# Altium schematic sheet 3G4G.SchDoc
size C
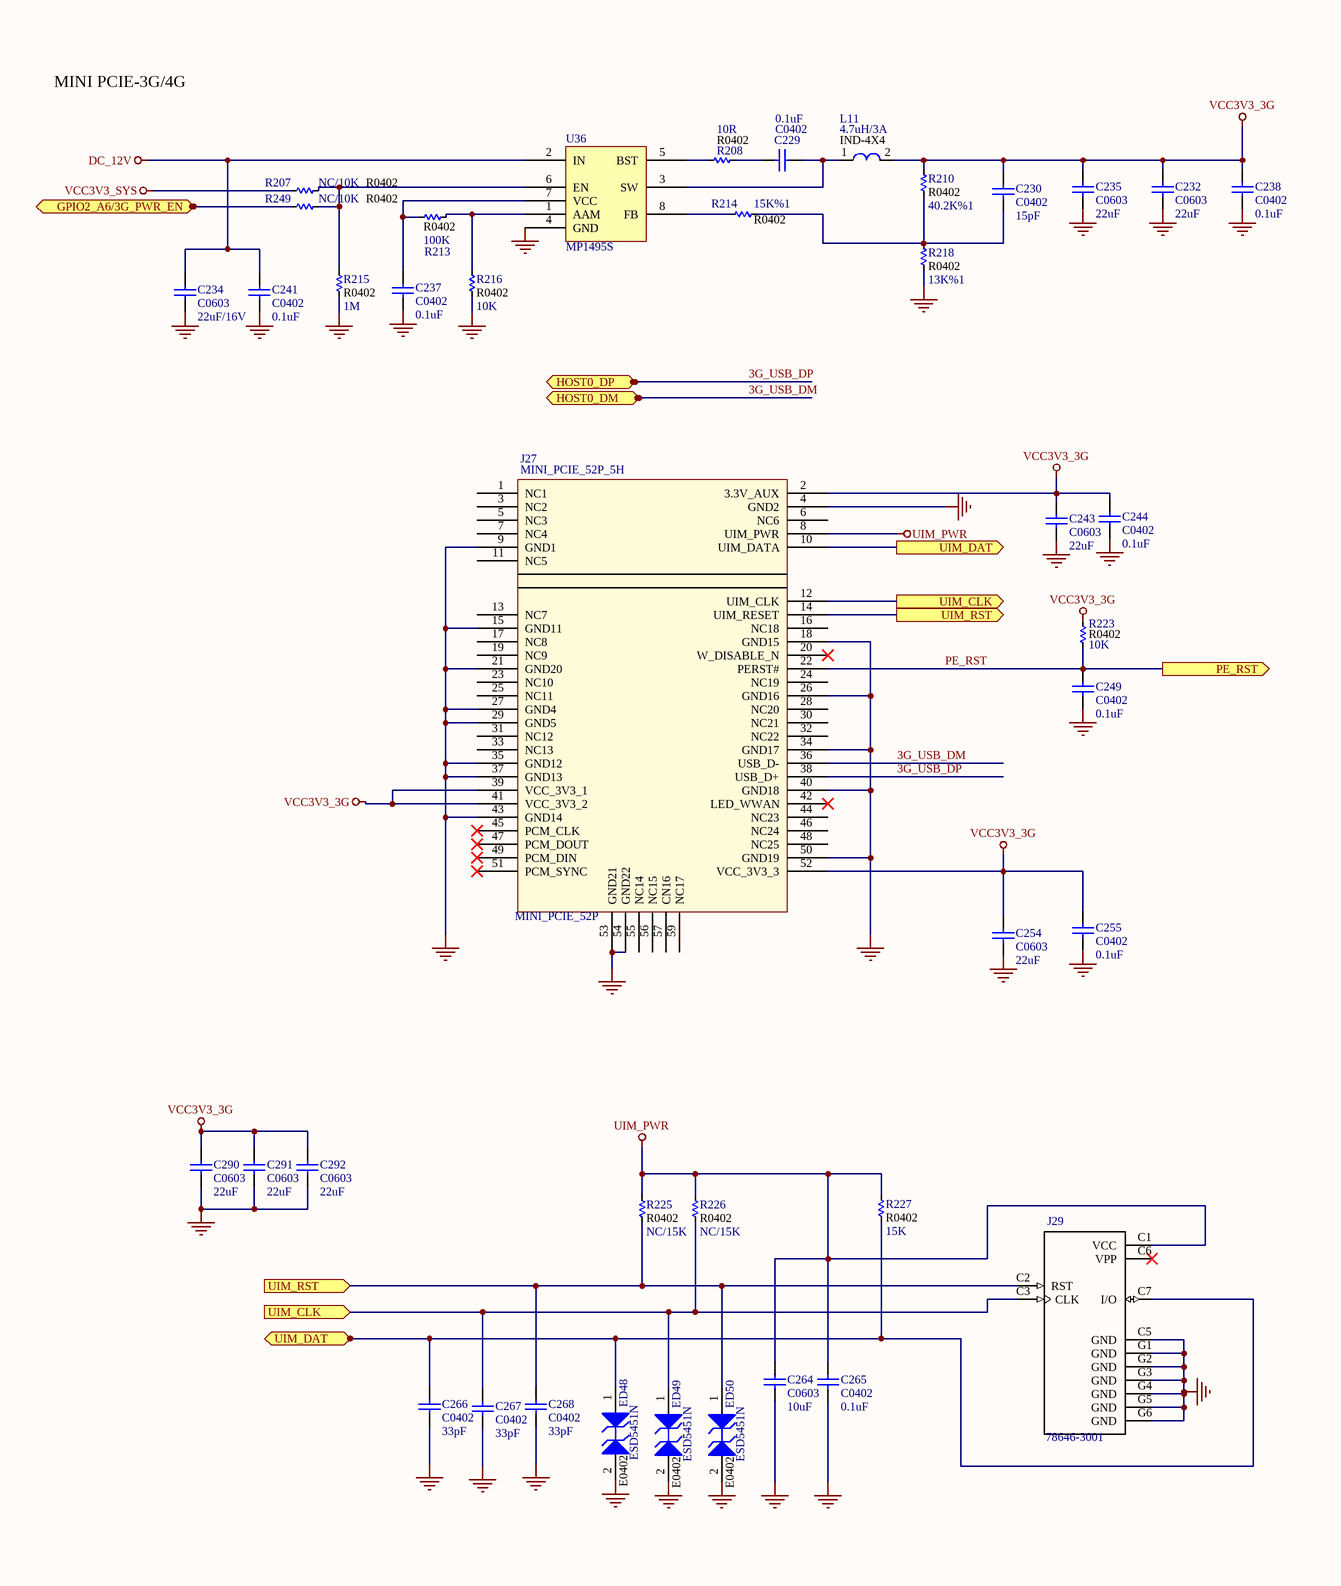
[diagram p0: 3G4G.SchDoc, left]
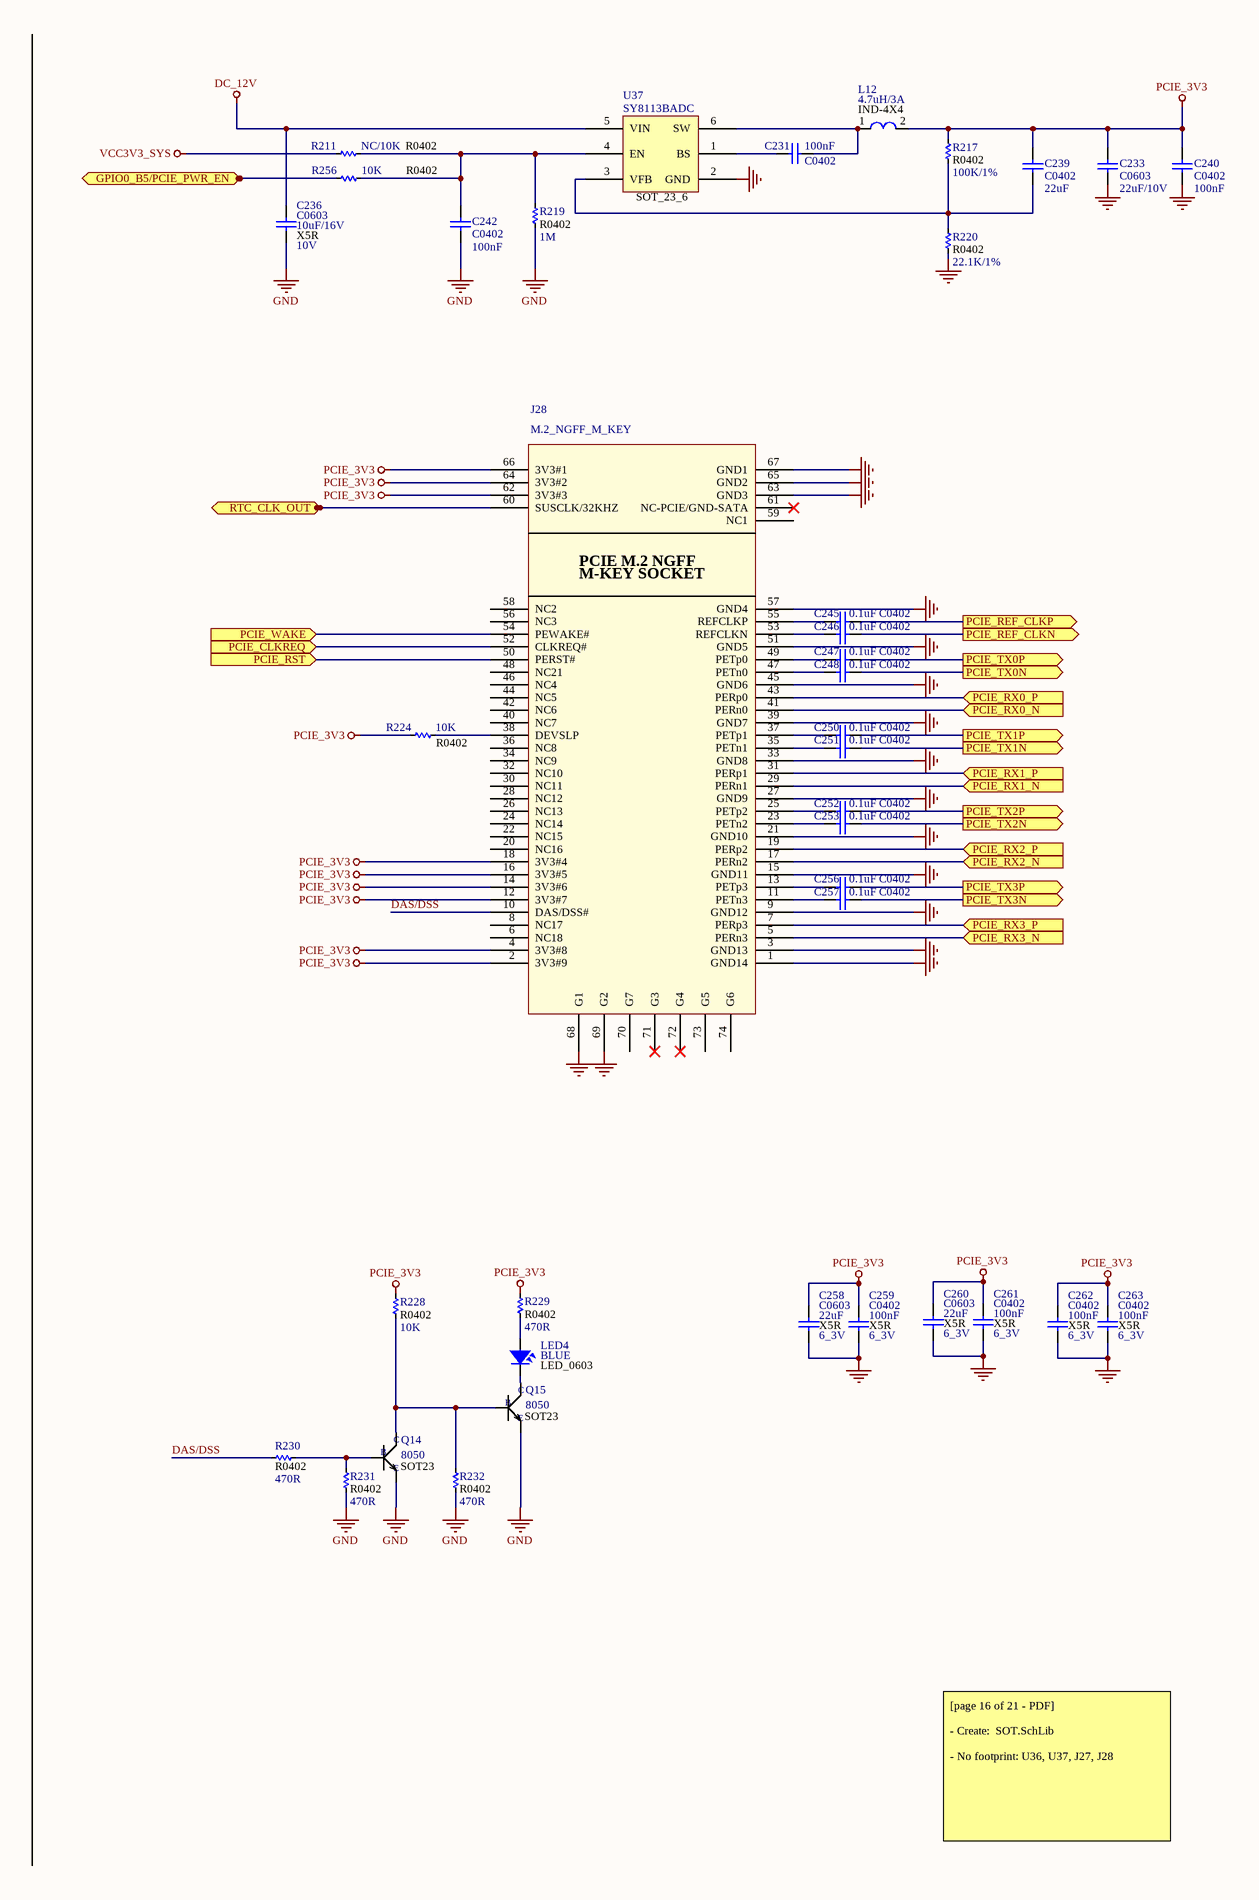
[diagram p1: 3G4G.SchDoc, right]

## Parts
C229  C0402  value 0.1uF  [C 0402]
C230  C0402  value 15pF  [C 0402]
C231  C0402  value 100nF  [C 0402]
C232  C0603  value 22uF  [C 0603]
C233  C0603  value 22uF/10V  [C 0603]
C234  C0603  value 22uF/16V  [C 0603]
C235  C0603  value 22uF  [C 0603]
C236  C0603  value 10uF/16V  [C 0603]
C237  C0402  value 0.1uF  [C 0402]
C238  C0402  value 0.1uF  [C 0402]
C239  C0402  value 22uF  [C 0402]
C240  C0402  value 100nF  [C 0402]
C241  C0402  value 0.1uF  [C 0402]
C242  C0402  value 100nF  [C 0402]
C243  C0603  value 22uF  [C 0603]
C244  C0402  value 0.1uF  [C 0402]
C245  C0402  value 0.1uF  [C 0402]
C246  C0402  value 0.1uF  [C 0402]
C247  C0402  value 0.1uF  [C 0402]
C248  C0402  value 0.1uF  [C 0402]
C249  C0402  value 0.1uF  [C 0402]
C250  C0402  value 0.1uF  [C 0402]
C251  C0402  value 0.1uF  [C 0402]
C252  C0402  value 0.1uF  [C 0402]
C253  C0402  value 0.1uF  [C 0402]
C254  C0603  value 22uF  [C 0603]
C255  C0402  value 0.1uF  [C 0402]
C256  C0402  value 0.1uF  [C 0402]
C257  C0402  value 0.1uF  [C 0402]
C258  C0603  value 22uF  [C 0603]
C259  C0402  value 100nF  [C 0402]
C260  C0603  value 22uF  [C 0603]
C261  C0402  value 100nF  [C 0402]
C262  C0402  value 100nF  [C 0402]
C263  C0402  value 100nF  [C 0402]
C264  C0603  value 10uF  [C 0603]
C265  C0402  value 0.1uF  [C 0402]
C266  C0402  value 33pF  [C 0402]
C267  C0402  value 33pF  [C 0402]
C268  C0402  value 33pF  [C 0402]
C290  C0603  value 22uF  [C 0603]
C291  C0603  value 22uF  [C 0603]
C292  C0603  value 22uF  [C 0603]
ED48  ESD5451N  size: E0402  [DFN1006-2L]
ED49  ESD5451N  size: E0402  [DFN1006-2L]
ED50  ESD5451N  size: E0402  [DFN1006-2L]
J27  MINI_PCIE_52P_5H  [MINI_PCIE_52PIN]
J28  M.2_NGFF_M_KEY  [*CONN_1-2199230-5_1-2199230-5(Primary)]
J29  78646-3001  [*CONN_78646-3001_78646-3001(Primary)]
L11  4.7uH/3A  [L-SMD-M-7.3x4.5]
L12  4.7uH/3A  [L-SMD-M-7.3x4.5]
LED4  Package: LED_0603  Color: BLUE  [SM-LED-0805-Blue]  (hidden comment: LED SMD)
Q14  8050  [*SOT-23]
Q15  8050  [*SOT-23]
R207  R0402  value NC/10K  [R 0402]
R208  R0402  value 10R  [R 0402]
R210  R0402  value 40.2K%1  [R 0402]
R211  R0402  value NC/10K  [R 0402]
R213  R0402  value 100K  [R 0402]
R214  R0402  value 15K%1  [R 0402]
R215  R0402  value 1M  [R 0402]
R216  R0402  value 10K  [R 0402]
R217  R0402  value 100K/1%  [R 0402]
R218  R0402  value 13K%1  [R 0402]
R219  R0402  value 1M  [R 0402]
R220  R0402  value 22.1K/1%  [R 0402]
R223  R0402  value 10K  [R 0402]
R224  R0402  value 10K  [R 0402]
R225  R0402  value NC/15K  [R 0402]
R226  R0402  value NC/15K  [R 0402]
R227  R0402  value 15K  [R 0402]
R228  R0402  value 10K  [R 0402]
R229  R0402  value 470R  [R 0402]
R230  R0402  value 470R  [R 0402]
R231  R0402  value 470R  [R 0402]
R232  R0402  value 470R  [R 0402]
R249  R0402  value NC/10K  [R 0402]
R256  R0402  value 10K  [R 0402]
U36  MP1495S  [TSOT-23-8]
U37  SOT-23-6_SY8113BADC  [SOT-23-6]  (value not drawn)

## Ports
GPIO0_B5/PCIE_PWR_EN (in), GPIO2_A6/3G_PWR_EN (in), HOST0_DM (in), HOST0_DP (in), PCIE_CLKREQ (in), PCIE_REF_CLKN (out), PCIE_REF_CLKP (out), PCIE_RST (in), PCIE_RX0_N (in), PCIE_RX0_P (in), PCIE_RX1_N (in), PCIE_RX1_P (in), PCIE_RX2_N (in), PCIE_RX2_P (in), PCIE_RX3_N (in), PCIE_RX3_P (in), PCIE_TX0N (out), PCIE_TX0P (out), PCIE_TX1N (out), PCIE_TX1P (out), PCIE_TX2N (out), PCIE_TX2P (out), PCIE_TX3N (out), PCIE_TX3P (out), PCIE_WAKE (in), PE_RST (out), RTC_CLK_OUT (in), UIM_CLK (in), UIM_CLK (out), UIM_DAT (in), UIM_DAT (out), UIM_RST (in), UIM_RST (out)

## Nets
DC_12V: C234.1 C236.1 C241.1 U36.2(IN) U37.5(VIN)
GND: C232.1 C233.1 C234.2 C235.1 C236.2 C237.2 C238.1 C240.1 C241.2 C242.2 C243.1 C244.1 C249.1 C254.1 C255.1 C258.1 C259.1 C260.1 C261.1 C262.1 C263.1 C264.1 C265.1 C266.1 C267.1 C268.1 C290.1 C291.1 C292.1 ED48.2(A2) ED49.2(A2) ED50.2(A2) J27.4(GND2) J27.9(GND1) J27.15(GND11) J27.18(GND15) J27.21(GND20) J27.26(GND16) J27.27(GND4) J27.29(GND5) J27.34(GND17) J27.35(GND12) J27.37(GND13) J27.40(GND18) J27.43(GND14) J27.50(GND19) J27.53(GND21) J27.54(GND22) J28.1(GND14) J28.3(GND13) J28.9(GND12) J28.15(GND11) J28.21(GND10) J28.27(GND9) J28.33(GND8) J28.39(GND7) J28.45(GND6) J28.51(GND5) J28.57(GND4) J28.63(GND3) J28.65(GND2) J28.67(GND1) J28.68(G1) J28.69(G2) J29.C5(GND) J29.G1(GND) J29.G2(GND) J29.G3(GND) J29.G4(GND) J29.G5(GND) J29.G6(GND) Q14.2(E) Q15.2(E) R215.1 R216.1 R218.1 R219.2 R220.1 R231.2 R232.2 U36.4(GND) U37.2(GND)
PCIE_3V3: C233.2 C239.2 C240.2 C258.2 C259.2 C260.2 C261.2 C262.2 C263.2 J28.2(3V3#9) J28.4(3V3#8) J28.12(3V3#7) J28.14(3V3#6) J28.16(3V3#5) J28.18(3V3#4) J28.62(3V3#3) J28.64(3V3#2) J28.66(3V3#1) L12.2 R217.2 R224.2 R228.2 R229.2
UIM_PWR: C264.2 C265.2 J27.8(UIM_PWR) J29.C1(VCC) R225.2 R226.2 R227.2
VCC3V3_3G: C230.2 C232.2 C235.2 C238.2 C243.2 C244.2 C254.2 C255.2 C290.2 C291.2 C292.2 J27.2(3.3V_AUX) J27.39(VCC_3V3_1) J27.41(VCC_3V3_2) J27.52(VCC_3V3_3) L11.2 R210.2 R223.2
VCC3V3_SYS: R207.2 R211.2
3G_USB_DM: J27.36(USB_D-) ; port HOST0_DM
3G_USB_DP: J27.38(USB_D+) ; port HOST0_DP
DAS/DSS: J28.10(DAS/DSS#) R230.2
GPIO0_B5/PCIE_PWR_EN: R256.2 ; port GPIO0_B5/PCIE_PWR_EN
GPIO2_A6/3G_PWR_EN: R249.2 ; port GPIO2_A6/3G_PWR_EN
PCIE_CLKREQ: J28.52(CLKREQ#) ; port PCIE_CLKREQ
PCIE_REF_CLKN: C246.1 ; port PCIE_REF_CLKN
PCIE_REF_CLKP: C245.1 ; port PCIE_REF_CLKP
PCIE_RST: J28.50(PERST#) ; port PCIE_RST
PCIE_RX0_N: J28.41(PERn0) ; port PCIE_RX0_N
PCIE_RX0_P: J28.43(PERp0) ; port PCIE_RX0_P
PCIE_RX1_N: J28.29(PERn1) ; port PCIE_RX1_N
PCIE_RX1_P: J28.31(PERp1) ; port PCIE_RX1_P
PCIE_RX2_N: J28.17(PERn2) ; port PCIE_RX2_N
PCIE_RX2_P: J28.19(PERp2) ; port PCIE_RX2_P
PCIE_RX3_N: J28.5(PERn3) ; port PCIE_RX3_N
PCIE_RX3_P: J28.7(PERp3) ; port PCIE_RX3_P
PCIE_TX0N: C248.1 ; port PCIE_TX0N
PCIE_TX0P: C247.1 ; port PCIE_TX0P
PCIE_TX1N: C251.1 ; port PCIE_TX1N
PCIE_TX1P: C250.1 ; port PCIE_TX1P
PCIE_TX2N: C253.1 ; port PCIE_TX2N
PCIE_TX2P: C252.1 ; port PCIE_TX2P
PCIE_TX3N: C257.1 ; port PCIE_TX3N
PCIE_TX3P: C256.1 ; port PCIE_TX3P
PCIE_WAKE: J28.54(PEWAKE#) ; port PCIE_WAKE
PE_RST: C249.2 J27.22(PERST#) R223.1 ; port PE_RST
RTC_CLK_OUT: J28.60(SUSCLK/32KHZ) ; port RTC_CLK_OUT
UIM_CLK: C267.2 ED49.1(A1) J27.12(UIM_CLK) J29.C3(CLK) R226.1 ; port UIM_CLK
UIM_DAT: C266.2 ED48.1(A1) J27.10(UIM_DATA) J29.C7(I/O) R227.1 ; port UIM_DAT
UIM_RST: C268.2 ED50.1(A1) J27.14(UIM_RESET) J29.C2(RST) R225.1 ; port UIM_RST
NetC229_1: C229.1 R208.2
NetC229_2: C229.2 L11.1 U36.3(SW)
NetC230_1: C230.1 R210.1 R214.2 R218.2
NetC231_1: C231.1 L12.1 U37.6(SW)
NetC231_2: C231.2 U37.1(BS)
NetC237_1: C237.1 R213.1 U36.7(VCC)
NetC239_1: C239.1 R217.1 R220.2 U37.3(VFB)
NetC242_1: C242.1 R211.1 R219.1 R256.1 U37.4(EN)
NetC245_2: C245.2 J28.55(REFCLKP)
NetC246_2: C246.2 J28.53(REFCLKN)
NetC247_2: C247.2 J28.49(PETp0)
NetC248_2: C248.2 J28.47(PETn0)
NetC250_2: C250.2 J28.37(PETp1)
NetC251_2: C251.2 J28.35(PETn1)
NetC252_2: C252.2 J28.25(PETp2)
NetC253_2: C253.2 J28.23(PETn2)
NetC256_2: C256.2 J28.13(PETp3)
NetC257_2: C257.2 J28.11(PETn3)
NetJ28_38: J28.38(DEVSLP) R224.1
NetLED4_1: LED4.1 R229.1
NetLED4_2: LED4.2 Q15.3(C)
NetQ14_1: Q14.1(B) R230.1 R231.1
NetQ14_3: Q14.3(C) Q15.1(B) R228.1 R232.1
NetR207_1: R207.1 R215.2 R249.1 U36.6(EN)
NetR208_1: R208.1 U36.5(BST)
NetR213_2: R213.2 R216.2 U36.1(AAM)
NetR214_1: R214.1 U36.8(FB)

Not connected (* = marked no-connect by the designer): J27 1(NC1) 3(NC2) 5(NC3) 6(NC6) 7(NC4) 11(NC5) 13(NC7) 16(NC18) 17(NC8) 19(NC9) 20(W_DISABLE_N)* 23(NC10) 24(NC19) 25(NC11) 28(NC20) 30(NC21) 31(NC12) 32(NC22) 33(NC13) 42(LED_WWAN)* 44(NC23) 45(PCM_CLK)* 46(NC24) 47(PCM_DOUT)* 48(NC25) 49(PCM_DIN)* 51(PCM_SYNC)* 55(NC14) 56(NC15) 57(CN16) 59(NC17); J28 6(NC18) 8(NC17) 20(NC16) 22(NC15) 24(NC14) 26(NC13) 28(NC12) 30(NC11) 32(NC10) 34(NC9) 36(NC8) 40(NC7) 42(NC6) 44(NC5) 46(NC4) 48(NC21) 56(NC3) 58(NC2) 59(NC1) 61(NC-PCIE/GND-SATA)* 70(G7) 71(G3)* 72(G4)* 73(G5) 74(G6); J29 C6(VPP)*

## Notes on the sheet
- MINI PCIE-3G/4G
- [page 16 of 21 - PDF]
  - Create:  SOT.SchLib
  - No footprint: U36, U37, J27, J28
- (in symbol Cap) X5R; 6_3V; 10V
- (in symbol L-SMD-1) IND-4X4
- (in symbol M.2_NGFF_M_KEY) PCIE M.2 NGFF; M-KEY SOCKET
- (in symbol MINI_PCIE_52P_5H) MINI_PCIE_52P
- (in symbol SMD-TRANSISTORS-NPN-25V-500MW(SOT-23)) SOT23
- (in symbol SOT-23-6_SY8113BADC) SY8113BADC; SOT_23_6

## Library data of the parts
C229-C268 C290-C292 = Cap: Capacitor; Published: 8-Jun-2000; LatestRevisionDate: 17-Jul-2002; LatestRevisionNote: Re-released for DXP Platform.; PackageReference: RAD-0.3; Publisher: Altium Limited; PackageDescription: Radial Cap, Thru-Hole; 2 Leads; 0.3 in Pin Spacing
ED48-ED50 = 1SMB54CAT3: 600 W Peak Power Zener Transient Voltage Suppressor, Bidirectional, 2-Pin SMB, Tape and Reel; Manufacturer: On Semiconductor; IR Max (uA): 5; PPK Max (W): 600; V(BR) Typ (V): 63.16; DatasheetVersion: Rev. A; PackageVersion: Rev. A, 01/2000; PackageReference: SMB-2-403C-01; PackageDescription: 2-Pin Small Molded Package, J-Bend Lead, Body 4.315 x 3.555 mm; Supplier 1: Digi-Key; Supplier Part Number 1: 1SMB54CAT3-ND; Direction: Bidirectional; Packing: Tape and Reel; Mounting Technology: Surface Mount; PartNumber: 1SMB54CAT3; ComponentLink1Description: Manufacturer URL; ComponentLink1URL: http://www.onsemi.com/; ComponentLink2Description: Datasheet; ComponentLink2URL: http://www.onsemi.com/pub_link/Collateral/1SMB10CAT3-D.PDF; ComponentLink3Description: Package Specification; ComponentLink3URL: http://www.onsemi.com/pub_link/Collateral/1SMB10CAT3-D.PDF
J29 = 78646-3001: Conn Micro SIM Card SKT 6 POS 2.54mm Solder RA SMD 0.5A/Contact Embossed T/R; MF: Molex; Price: None; SnapEDA_Link: https://www.snapeda.com/parts/78646-3001/Molex/view-part/?ref=snap; Availability: Unavailable; MP: 78646-3001; Package: None; Value: *
L11 L12 = L-SMD-1: partNo: 78477010; Manufacturer: Wurth Elektronik; Inductance: 1.0 μH; ComponentLink1Description: Manufacturer; ComponentLink1URL: http://www.we-online.de; Created by: Baojun Chen; Created Date: Nov.2015; ComponentLink2Description: Datasheet; ComponentLink2URL: http://katalog.we-online.de/pbs/datasheet/78477010.pdf
LED4 = LED-SMD-0805
Q14 Q15 = SMD-TRANSISTORS-NPN-25V-500MW(SOT-23): MF: Recom Power; MP: S8050; Value: NC; Package: SMD-8 Samsung; Price: None; SnapEDA_Link: https://www.snapeda.com/parts/S8050/Recom%20Power/view-part/?ref=snap; Availability: Unavailable
R207 R208 R210 R211 R213-R220 R223-R232 R249 R256 = Res-SMD: Resistor; Manufacturer: Generic Components; Class: Passive; Published: 08/06/2000; Publisher: Altium Hobart Technology Centre
U37 = SOT-23-6_SY8113BADC: Switching Voltage Regulators 17 Vin,3A Sync SD Reg; Manufacturer: Texas Instruments; Manufacturer Part Number: TPS563200DDCR; Operating Supply Current: 190 uA; Supplier 1: Mouser; RoHS: RoHS Compliant; Category: Switching Voltage Regulators; Stock 1: 18637; Pricing 1: 1=1.44, 10=1.23, 100=0.947, 500=0.836, 1000=0.660, 3000=0.586, 9000=0.564 (USD); Height: 1.1 mm; Length: 2.9 mm; Operating Temperature Range: - 40 C to + 125 C; Package / Case: SOT-23-Thin-6; Packaging: Cut Tape; Series: TPS563200; Width: 1.6 mm; Brand: Texas Instruments; Mounting Style: SMD/SMT; Maximum Operating Temperature: + 125 C; Minimum Operating Temperature: - 40 C; Product Type: Switching Voltage Regulators; Standard Pack Qty: 3000; Subcategory: PMIC - Power Management ICs; RoHS - Mouser: Y; Minimum Order Quantity: 1; Reeling: True